# Altium schematic sheet Assign.SchDoc
size A4; SheetNumber: 1; SheetTotal: 1
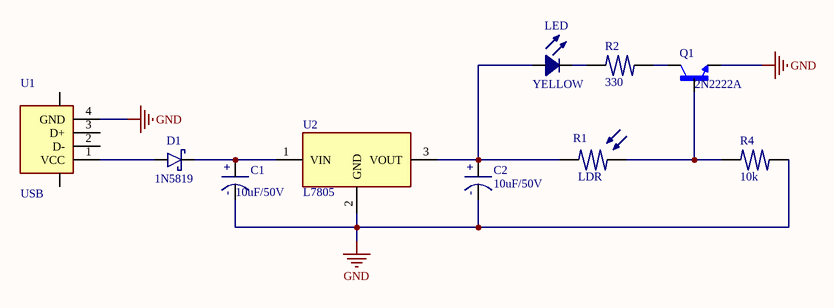
[diagram p0: Assign.SchDoc]

## Parts
C1  10uF/50V  [10uF/50V]
C2  10uF/50V  [10uF/50V]
D1  1N5819  [1N5819]
LED  YELLOW  [LED_0805_YELLOW]
Q1  2N2222A  [TO92254P470H750-3]
R1  LDR  [LDR]
R2  330  [RESISTOR_PTH_9.5mm]
R4  10k  [RESISTOR_PTH_9.5mm]
U1  USB  [USB]
U2  L7805  [L7805_smd]

## Nets
GND: C1.1 C2.1 Q1.1(E) R4.2 U1.4(GND) U2.2(GND)
NetC1_2: C1.2 D1.2 U2.1(VIN)
NetC2_2: C2.2 LED.1 R1.1 U2.3(VOUT)
NetD1_1: D1.1 U1.1(VCC)
NetLED_2: LED.2 R2.1
NetQ1_2: Q1.2(B) R1.2 R4.1
NetQ1_3: Q1.3(C) R2.2

Not connected (* = marked no-connect by the designer): U1 2(D-) 3(D+)

## Notes on the sheet
- (in symbol 10uF/50V) +; -

## Library data of the parts
C1 C2 = 10uF/50V: Electrolytic Capacitor 10uF/50V
D1 = 1N5819: Rectifier Schottky 40V 1A DO-15; Mouser PN: 637-1N5819; ComponentLink1Description: Datasheet; ComponentLink1URL: https://www.mouser.com/datasheet/2/849/1n5817-2577238.pdf; Digikey PN: 497-6610-1-ND; JLCPCB PN: C437199
LED = LED_0805_YELLOW: LED 0805 Yellow.; JLCPCB PN: C84261
Q1 = 2N2222A: Bipolar (BJT) Transistor NPN 40 V 600 mA 250MHz 625 mW Through Hole TO-92; MF: Diotec Semiconductor; Package: TO-92-3 Diotec; Check_prices: https://www.snapeda.com/parts/2N2222A/Diotec/view-part/?ref=eda; Value: *; Purchase-URL: https://pricing.snapeda.com/search/part/2N2222A/?ref=eda; Availability: In Stock; SnapEDA_Link: https://www.snapeda.com/parts/2N2222A/Diotec/view-part/?ref=snap; MP: 2N2222A; Price: None
R1 = LDR: LIGHT DEPENDEND RESISTOR/PHOTORESITOR; Digikey PN: PDV-P8107-ND
R2 R4 = RESISTOR_9.5mm: Generic Resistor 9.5mm.
U2 = L7805: IC REG LINEAR 5V 1.5A TO220AB; ComponentLink1Description: Datasheet; ComponentLink1URL: https://www.mouser.com/datasheet/2/389/l78-1849632.pdf; Mouser PN: 511-L7805CV; Digikey PN: 497-1443-5-ND; JLCPCB PN PTH: C347289; JLCPCB PN SMD: C15077